# EAGLE schematic Lower_Chassis (EAGLE 7.7.0)
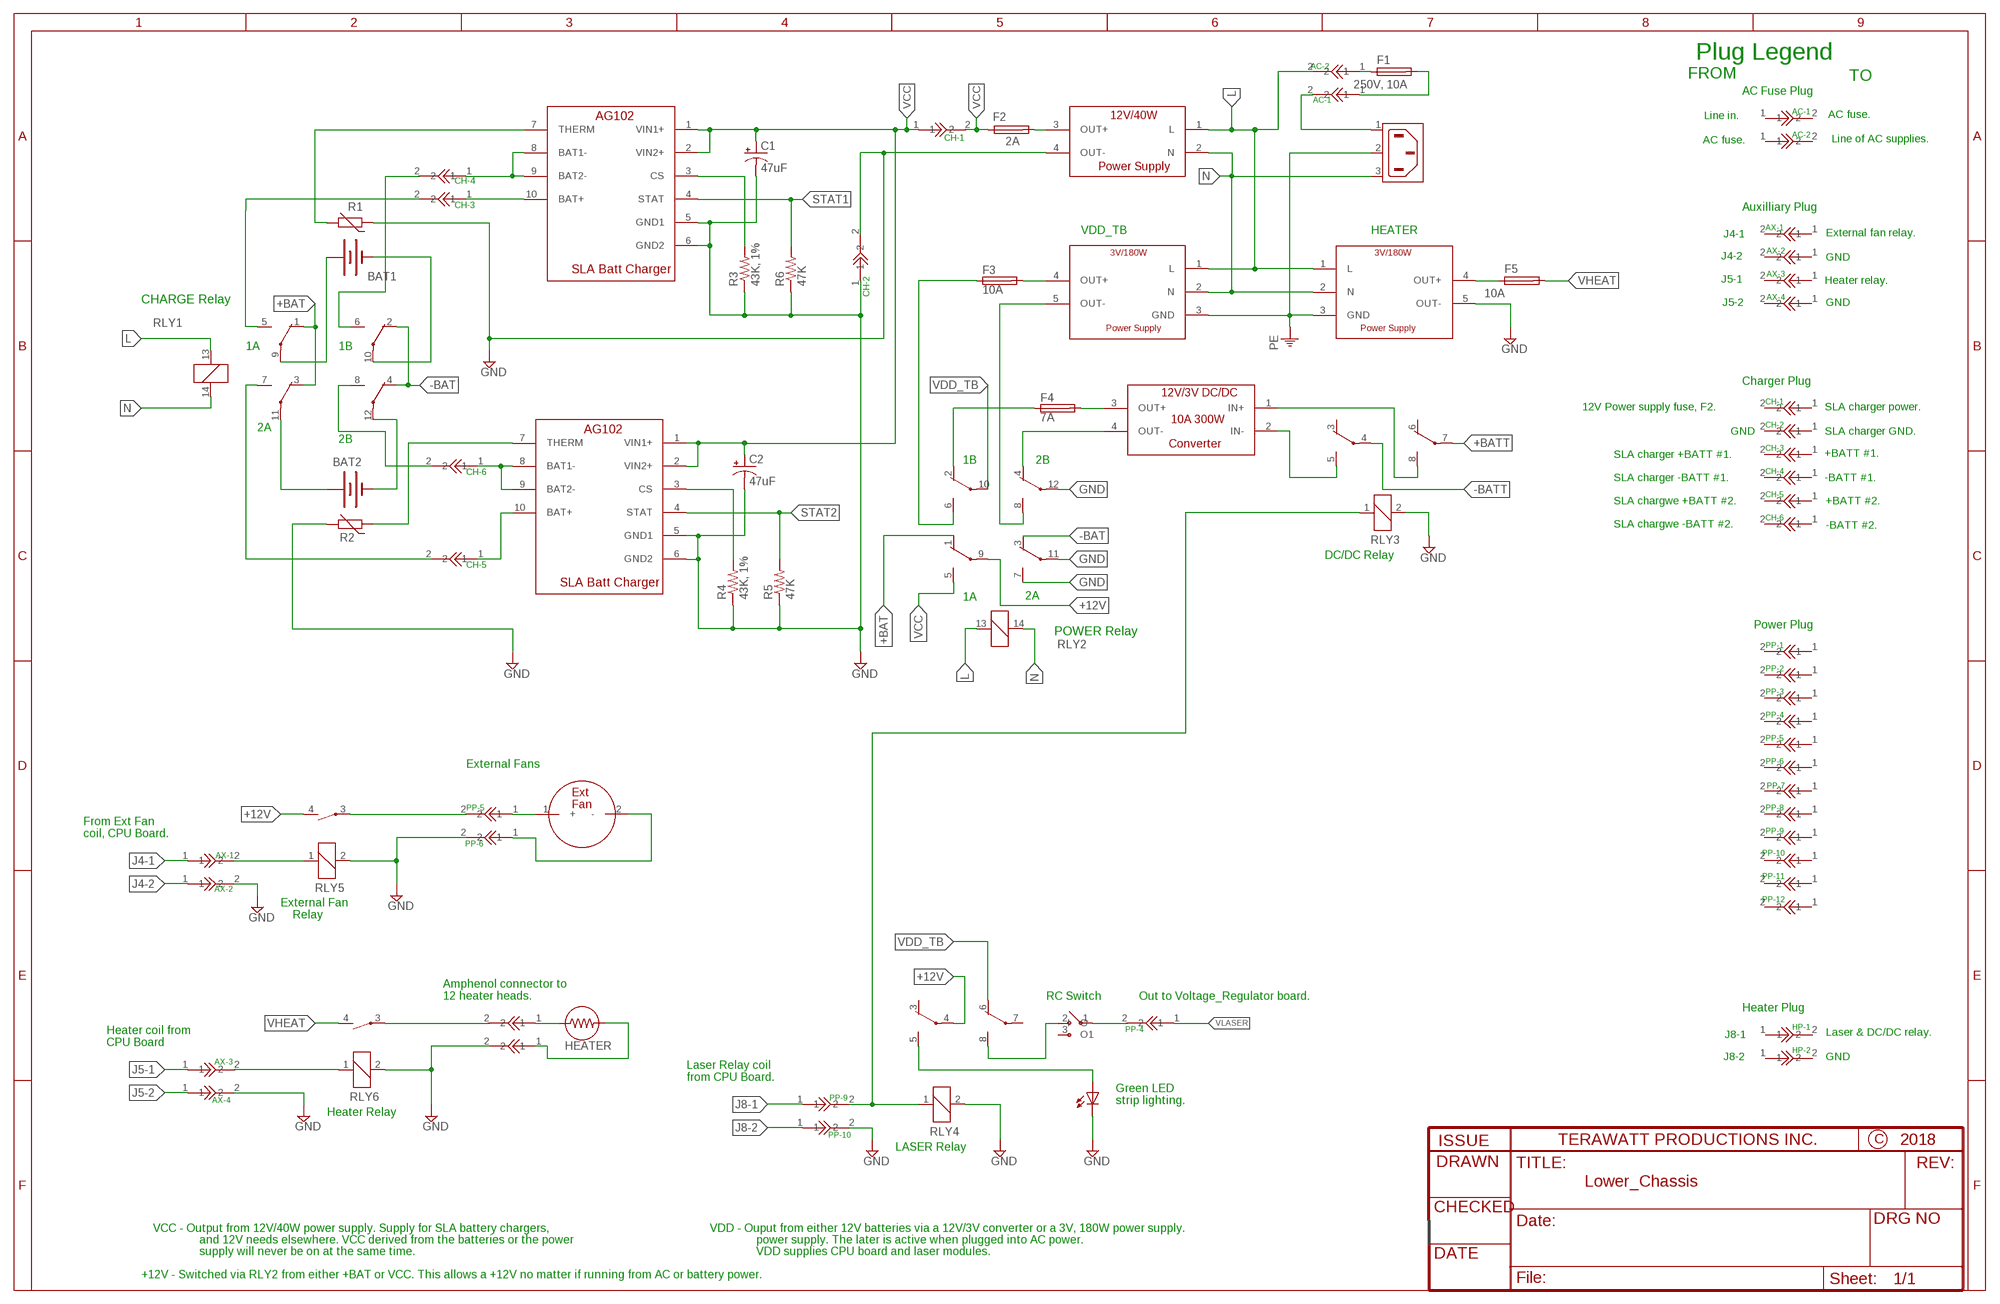
[diagram p0: schematic, sheet 1]

## Parts
AX-3  AX-3  PLUG_CONN  [22-23-2021]
BAT1  BATTERY  [12V_BATT]
BAT2  BATTERY  [12V_BATT]
C1  47uF  CPOL-USE5-10.5  [E5-10,5]
C2  47uF  CPOL-USE5-10.5  [E5-10,5]
CHG1  AG102_SLA_CHARGER  [22-23-2101]
CHG2  AG102_SLA_CHARGER  [22-23-2101]
F1  250V, 10A  SH22,5  [SH22,5]
F2  2A  SH22,5  [SH22,5]
F3  10A  SH22,5  [SH22,5]
F4  7A  SH22,5  [SH22,5]
F5  10A  SH22,5  [SH22,5]
LED1  LED5MM  [LED5MM]
M1  EXT_FAN  [22-23-2021]
P1  12V/3V_DC/DC_CONVERTER  [12V/3V_DC/DC_CONVERTER]
PS1  12V/40W_POWER_SUPPLY  [12V/40W_POWER_SUPPLY]
PS2  3V/180W_POWER_SUPPLY  [3V/180W_POWER_SUPPLY]
PS3  3V/180W_POWER_SUPPLY  [3V/180W_POWER_SUPPLY]
R1  THERMISTOR-2,5  [RS-2,5]
R2  THERMISTOR-2,5  [RS-2,5]
R3  43K, 1%  R-US_R0805  [R0805]
R4  43K, 1%  R-US_R0805  [R0805]
R5  47K  R-US_R0805  [R0805]
R6  47K  R-US_R0805  [R0805]
RLY1  4P4T_RELAYS  [22-23-2071-2]
RLY2  4P4T_RELAYS  [22-23-2071-2]
RLY3  DPDT_RELAY  [DPDT_RELAY]
RLY4  DPDT_RELAY  [DPDT_RELAY]
RLY5  RELAY_SPST  [RELAY_SPST]
RLY6  RELAY_SPST  [RELAY_SPST]
S1  SPST_TOGGLE_W_GND  [22-23-2031]
U$1  PLUG_CONN  [22-23-2021]
U$2  PLUG_CONN  [22-23-2021]
U$3  PLUG_CONN  [22-23-2021]
U$4  HEATER  [22-23-2021]
U$5  PLUG_CONN  [22-23-2021]
U$6  PLUG_CONN  [22-23-2021]
U$7  PLUG_CONN  [22-23-2021]
U$8  PLUG_CONN  [22-23-2021]
U$9  PLUG_CONN  [22-23-2021]
U$10  PLUG_CONN  [22-23-2021]
U$11  PLUG_CONN  [22-23-2021]
U$12  PLUG_CONN  [22-23-2021]
U$13  PLUG_CONN  [22-23-2021]
U$14  PLUG_CONN  [22-23-2021]
U$15  PLUG_CONN  [22-23-2021]
U$16  PLUG_CONN  [22-23-2021]
U$17  PLUG_CONN  [22-23-2021]
U$18  PLUG_CONN  [22-23-2021]
U$19  PLUG_CONN  [22-23-2021]
U$20  PLUG_CONN  [22-23-2021]
U$21  PLUG_CONN  [22-23-2021]
U$22  PLUG_CONN  [22-23-2021]
U$23  PLUG_CONN  [22-23-2021]
U$24  PLUG_CONN  [22-23-2021]
U$25  PLUG_CONN  [22-23-2021]
U$26  PLUG_CONN  [22-23-2021]
U$27  PLUG_CONN  [22-23-2021]
U$28  PLUG_CONN  [22-23-2021]
U$29  PLUG_CONN  [22-23-2021]
U$30  PLUG_CONN  [22-23-2021]
U$31  PLUG_CONN  [22-23-2021]
U$32  PLUG_CONN  [22-23-2021]
U$33  PLUG_CONN  [22-23-2021]
U$34  PLUG_CONN  [22-23-2021]
U$35  PLUG_CONN  [22-23-2021]
U$36  PLUG_CONN  [22-23-2021]
U$37  PLUG_CONN  [22-23-2021]
U$38  PLUG_CONN  [22-23-2021]
U$39  PLUG_CONN  [22-23-2021]
U$40  PLUG_CONN  [22-23-2021]
U$41  PLUG_CONN  [22-23-2021]
U$42  PLUG_CONN  [22-23-2021]
U$43  PLUG_CONN  [22-23-2021]
U$44  PLUG_CONN  [22-23-2021]
U$45  PLUG_CONN  [22-23-2021]
X1  6ESRM-P  [6ESRM-P]

## Nets
+12V: RLY2.9(1:P) RLY4.4(2:P) RLY5.4(2:S)
+BAT: RLY1.1(1:O) RLY1.3(3:O) RLY2.1(1:O)
+BATT: RLY3.7(3:P)
-BAT: RLY1.2(2:O) RLY1.4(4:O) RLY2.3(3:O)
-BATT: RLY3.4(2:P)
GND: C1.- C2.- CHG1.5(GND1) CHG1.6(GND2) CHG2.5(GND1) CHG2.6(GND2) LED1.K(C) PS1.4(OUT-) PS3.5(OUT-) R1.1 R2.2 R3.1 R4.1 R5.1 R6.1 RLY2.7(3:S) RLY2.11(3:P) RLY2.12(4:P) RLY3.2 RLY4.2 RLY5.2 RLY6.2 U$2.2 U$5.2 U$7.2 U$9.2 U$10.2 U$40.1 U$40.2
HEAT_RLY: AX-3.2 RLY5.1 RLY6.1 U$6.2
J4-1: U$6.1
J4-2: U$7.1
J5-1: AX-3.1
J5-2: U$5.1
J8-1: U$8.1
J8-2: U$9.1
L: PS1.1(L) PS2.1(L) PS3.1(L) RLY1.13 RLY2.13 U$12.2
LASRLY: RLY3.1 RLY4.1 U$8.2
N: PS1.2(N) PS2.2(N) PS3.2(N) RLY1.14 RLY2.14 X1.3(AC2)
N$1: P1.4(OUT-) RLY2.4(4:O)
N$2: F3.1 RLY2.6(2:S)
N$3: BAT1.1(+) RLY1.9(1:P)
N$4: BAT1.2(-) RLY1.10(2:P)
N$5: BAT2.1(+) RLY1.11(3:P)
N$6: RLY1.6(2:S) U$42.2
N$7: CHG1.3(CS) R3.2
N$8: BAT2.2(-) RLY1.12(4:P)
N$9: F4.1 RLY2.2(2:O)
N$10: PS2.5(OUT-) RLY2.8(4:S)
N$11: RLY1.5(1:S) U$43.2
N$12: CHG1.7(THERM) R1.2
N$13: CHG2.3(CS) R4.2
N$14: CHG2.7(THERM) R2.1
N$15: RLY1.8(4:S) U$44.2
N$16: U$13.2 X1.1(AC1)
N$17: RLY1.7(3:S) U$45.2
N$18: F2.2 PS1.3(OUT+)
N$19: F3.2 PS2.4(OUT+)
N$20: F4.2 P1.3(OUT+)
N$21: P1.2(IN-) RLY3.5(2:S)
N$22: P1.1(IN+) RLY3.8(3:S)
N$23: RLY4.8(3:S) S1.2(O)
N$24: RLY6.3(2:P) U$1.2
N$25: U$1.1 U$4.1
N$26: M1.1(+) U$3.1
N$27: U$2.1 U$4.2
N$28: F5.1 PS3.4(OUT+)
N$29: LED1.A RLY4.5(2:S)
N$30: M1.2(-) U$10.1
N$31: RLY5.3(2:P)
N$32: S1.1(I) U$11.2
N$33: F1.2 U$13.1
N$34: F1.1 U$12.1
N$35: CHG1.8(BAT1-) CHG1.9(BAT2-) U$42.1
N$36: CHG1.10(BAT+) U$43.1
N$37: CHG2.8(BAT1-) CHG2.9(BAT2-) U$44.1
N$38: CHG2.10(BAT+) U$45.1
PE: PS2.3(GND) PS3.3(GND) X1.2(SH)
STAT1: CHG1.4(STAT) R6.2
STAT2: CHG2.4(STAT) R5.2
VCC: C1.+ C2.+ CHG1.1(VIN1+) CHG1.2(VIN2+) CHG2.1(VIN1+) CHG2.2(VIN2+) F2.1 RLY2.5(1:S) U$41.1 U$41.2
VDD_TB: RLY2.10(2:P) RLY4.6(3:O)
VHEAT: F5.2 RLY6.4(2:S)
VLASER: U$11.1
Unconnected: RLY3.3(2:O) RLY3.6(3:O) RLY4.3(2:O) RLY4.7(3:P) S1.3(O1) U$3.2 U$14.1 U$14.2 U$15.1 U$15.2 U$16.1 U$16.2 U$17.1 U$17.2 U$18.1 U$18.2 U$19.1 U$19.2 U$20.1 U$20.2 U$21.1 U$21.2 U$22.1 U$22.2 U$23.1 U$23.2 U$24.1 U$24.2 U$25.1 U$25.2 U$26.1 U$26.2 U$27.1 U$27.2 U$28.1 U$28.2 U$29.1 U$29.2 U$30.1 U$30.2 U$31.1 U$31.2 U$32.1 U$32.2 U$33.1 U$33.2 U$34.1 U$34.2 U$35.1 U$35.2 U$36.1 U$36.2 U$37.1 U$37.2 U$38.1 U$38.2 U$39.1 U$39.2

## Notes on the sheet
- Plug Legend
- AC-2
- FROM | TO
- AC Fuse Plug
- AC-1
- AC-1
- Line in. | AC fuse.
- AC-2
- CH-1 | AC fuse. | Line of AC supplies.
- CH-4
- CH-3 | Auxilliary Plug
- AX-1
- VDD_TB | HEATER | External fan relay.
- J4-1
- AX-2
- J4-2 | GND
- AX-3
- J5-1 | Heater relay.
- CH-2
- AX-4
- CHARGE Relay | J5-2 | GND
- 1A | 1B
- Charger Plug
- CH-1
- 12V Power supply fuse, F2. | SLA charger power.
- CH-2
- 2A
- GND | SLA charger GND.
- 2B
- CH-3
- SLA charger +BATT #1. | +BATT #1.
- 1B | 2B
- CH-6 | CH-4
- SLA charger -BATT #1. | -BATT #1.
- CH-5
- SLA chargwe +BATT #2. | +BATT #2.
- CH-6
- SLA chargwe -BATT #2. | -BATT #2.
- DC/DC Relay
- CH-5
- 1A | 2A
- Power Plug
- POWER Relay
- PP-1
- PP-2
- PP-3
- PP-4
- PP-5
- PP-6
- External Fans
- PP-7
- PP-5 | PP-8
- PP-9
- From Ext Fan
  coil, CPU Board.
- PP-6
- PP-10
- AX-1
- PP-11
- AX-2
- PP-12
- External Fan 
      Relay
- Amphenol connector to 
  12 heater heads.
- RC Switch | Out to Voltage_Regulator board.
- Heater Plug
- HP-1
- PP-4
- J8-1 | Laser & DC/DC relay.
- Heater coil from
  CPU Board
- HP-2
- J8-2 | GND
- AX-3
- Laser Relay coil
  from CPU Board.
- AX-4 | PP-9
- Green LED 
  strip lighting.
- Heater Relay
- PP-10
- LASER Relay
- VCC - Output from 12V/40W power supply. Supply for SLA battery chargers, | VDD - Ouput from either 12V batteries via a 12V/3V converter or a 3V, 180W power supply.
- and 12V needs elsewhere. VCC derived from the batteries or the power | power supply. The later is active when plugged into AC power.
- supply will never be on at the same time. | VDD supplies CPU board and laser modules.
- +12V - Switched via RLY2 from either +BAT or VCC. This allows a +12V no matter if running from AC or battery power.

## Library data of the parts
AX-3 U$1-U$3 U$5-U$45 = Mine:PLUG_CONN
BAT1 BAT2 = Mine:BATTERY: BATTERY
C1 C2 = Mine:CPOL-US: POLARIZED CAPACITOR, American symbol
CHG1 CHG2 = Mine:AG102_SLA_CHARGER
F1-F5 = fuse:SH22,5: FUSE HOLDER grid 22,5 mm, OGN0031 8201, Schurter (Buerklin); MF: SCHURTER; MPN: 0031.8201; OC_FARNELL: 1162740; OC_NEWARK: 96F8317
LED1 = Mine:LED: LED OSRAM: - CHIPLED LG R971, LG N971, LY N971, LG Q971, LY Q971, LO R971, LY R971 LH N974, LH R974 LS Q976, LO Q976, LY Q976 LO Q996 - Hyper CHIPLED LW Q18S LB Q993, LB Q99A, LB R99A - SideLED LS A670, LO A670, LY A670, LG A670, LP A670 LB A673, LV A673, LT A673, LW A673 LH A674 LY A675 LS A676, LA A676, LO A676, LY A676, LW A676 LS A679, LY A679, LG A679 - Hyper Micro SIDELED® LS Y876, LA Y876, LO Y876, LY Y876 LT Y87S - SmartLED LW L88C, LW L88S LB L89C, LB L89S, LG L890 LS L89K, LO L89K, LY L89K LS L896, LA L896, LO L896, LY L896 - TOPLED LS T670, LO T670, LY T670, LG T670, LP T670 LSG T670, LSP T670, LSY T670, LOP T670, LYG T670 LG T671, LOG T671, LSG T671 LB T673, LV T673, LT T673, LW T673 LH T674 LS T676, LA T676, LO T676, LY T676, LB T676, LH T676, LSB T676, LW T676 LB T67C, LV T67C, LT T67C, LS T67K, LO T67K, LY T67K, LW E67C LS E67B, LA E67B, LO E67B, LY E67B, LB E67C, LV E67C, LT E67C LW T67C LS T679, LY T679, LG T679 LS T770, LO T770, LY T770, LG T770, LP T770 LB T773, LV T773, LT T773, LW T773 LH T774 LS E675, LA E675, LY E675, LS T675 LS T776, LA T776, LO T776, LY T776, LB T776 LHGB T686 LT T68C, LB T68C - Hyper Mini TOPLED® LB M676 - Mini TOPLED Santana® LG M470 LS M47K, LO M47K, LY M47K Source: http://www.osram.convergy.de/
M1 = Mine:EXT_FAN
P1 = Mine:12V/3V_DC/DC_CONVERTER
PS1 = Mine:12V/40W_POWER_SUPPLY: 12V/40W Power Supply.
PS2 PS3 = Mine:3V/180W_POWER_SUPPLY: 3V/180W power Supply.
R1 R2 = Mine:THERMISTOR: THERMISTOR
R3-R6 = rcl:R-US_: RESISTOR, American symbol
RLY1 RLY2 = Mine:4P4T_RELAYS: FLATPACK RELAY NAiS Source: http://www.mew-europe.com/.. en_ds_61014_0000.pdf
RLY3 RLY4 = Mine:DPDT_RELAY: RELAY 2 x switch, Finder
RLY5 RLY6 = Mine:RELAY_SPST: Miniature PCB Relay 1 pole 6 A SCHRACK Source: http://www.schrack.com/.. 5812.pdf
S1 = Mine:SPST_TOGGLE_W_GND
U$4 = Mine:HEATER
X1 = con-tycoelectronics:6ESRM-P: AC Connector 120/250 VAC Source: http://catalog.tycoelectronics.com .. ENG_DS_1654001_1099_SR_0406.pdf; MF: TYCO ELECTRONICS; MPN: 6ESRM-P; OC_FARNELL: unknown; OC_NEWARK: 87F1821